# Altium project 4.0 - Nonisolated_DCDC_3BUCK-1BOOST_AUX_Power.PrjPcb
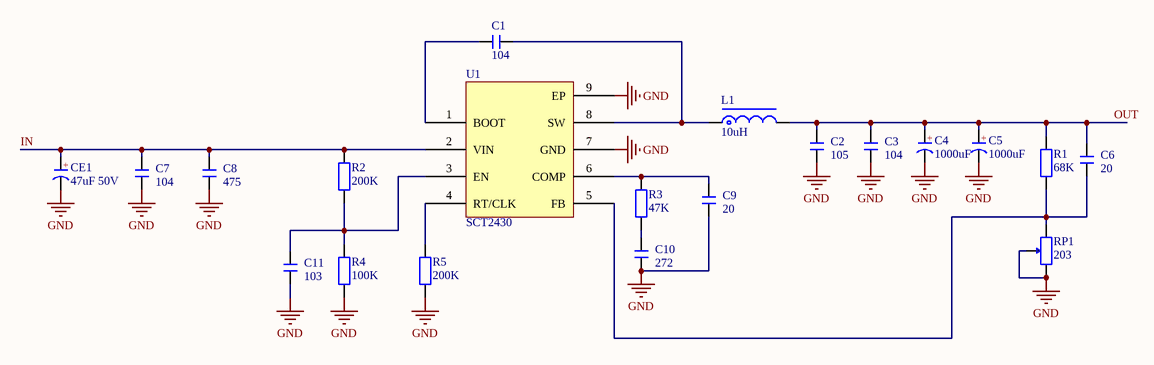
[diagram p0: SCT2XX0 STEP-DOWM.SchDoc]
2 sheets, 39 parts. Net scope: global (net labels, ports and power ports of the same name join across sheets).
Board file: Power Board.PcbDoc
Sheets:
  SCT2XX0 STEP-DOWM.SchDoc
  SCT12A0 BOOST.SchDoc

## Sheet SCT2XX0 STEP-DOWM.SchDoc
size A4; Organization: Altium Limited; Address1: L3, 12a Rodborough Rd; Address2: Frenchs Forest; Address3: NSW; Address4: Australia 2086

### Parts
C1  104  [C 0805_L]
C2  105  [C 0805_L]
C3  104  [C 0805_L]
C4  1000uF  [CAP 7.5*16*25]
C5  1000uF  [CAP 5.0*12.5*20]
C6  20  [C 0805_L]
C7  104  [C 0805_L]
C8  475  [C 0805_L]
C9  20  [C 0805_L]
C10  272  [C 0805_L]
C11  103  [C 0805_L]
CE1  47uF 50V  [CM C(5*5.4)]
L1  10uH  [CDRH127]
R1  68K  [R 0805_L]
R2  200K  [R 0805_L]
R3  47K  [R 0805_L]
R4  100K  [R 0805_L]
R5  200K  [R 0805_L]
RP1  203  [3296W]
U1  SCT2430  [ESOP8_N]

### Nets
GND: C2.1 C3.1 C4.2(K) C5.2(K) C7.1 C8.1 C9.1 C10.1 C11.1 CE1.2(K) R4.1 R5.1 RP1.1 RP1.2 U1.7(GND) U1.9(EP)
IN: C7.2 C8.2 CE1.1(A) R2.2 U1.2(VIN)
OUT: C2.2 C3.2 C4.1(A) C5.1(A) C6.2 L1.2 R1.2
NetC1_1: C1.1 U1.1(BOOT)
NetC1_2: C1.2 L1.1 U1.8(SW)
NetC6_1: C6.1 R1.1 RP1.3 U1.5(FB)
NetC9_2: C9.2 R3.2 U1.6(COMP)
NetC10_2: C10.2 R3.1
NetC11_2: C11.2 R2.1 R4.2 U1.3(EN)
NetR5_2: R5.2 U1.4(RT/CLK)

### Notes on the sheet
- Title
- Size:
- Date:
- A4
- Number:
- Time:
- Revision:
- Sheet
- of
- File:
- (in symbol CE) +
- (in symbol CE_SMD) +

### Library data of the parts
C1-C3 C6-C11 = C: 贴片电容; 淘宝ID: 小糖豆的小窝窝; BOM名称: 贴片电容; 下单链接: https://item.taobao.com/item.htm?ft=t&id=613637044352
C4 C5 = CE: 直插电解电容; 淘宝ID: 小糖豆的小窝窝; BOM名称: 直插电解电容; 下单链接: https://item.taobao.com/item.htm?ft=t&id=613637044352
CE1 = CE_SMD: 贴片电解电容; 淘宝ID: 小糖豆的小窝窝; BOM名称: 贴片电解电容; 下单链接: https://item.taobao.com/item.htm?ft=t&id=613637044352
L1 = L-CDRH: 功率屏蔽电感; 淘宝ID: 小糖豆的小窝窝; BOM名称: 功率屏蔽电感; 下单链接: https://item.taobao.com/item.htm?ft=t&id=613637044352
R1-R5 = R: 贴片电阻; 淘宝ID: 小糖豆的小窝窝; BOM名称: 贴片电阻; 下单链接: https://item.taobao.com/item.htm?ft=t&id=613637044352
RP1 = RP: 单联电位器; 淘宝ID: 小糖豆的小窝窝; BOM名称: 单联电位器; 下单链接: https://item.taobao.com/item.htm?ft=t&id=613637044352

## Sheet SCT12A0 BOOST.SchDoc
size A4; Organization: Altium Limited; Address1: L3, 12a Rodborough Rd; Address2: Frenchs Forest; Address3: NSW; Address4: Australia 2086
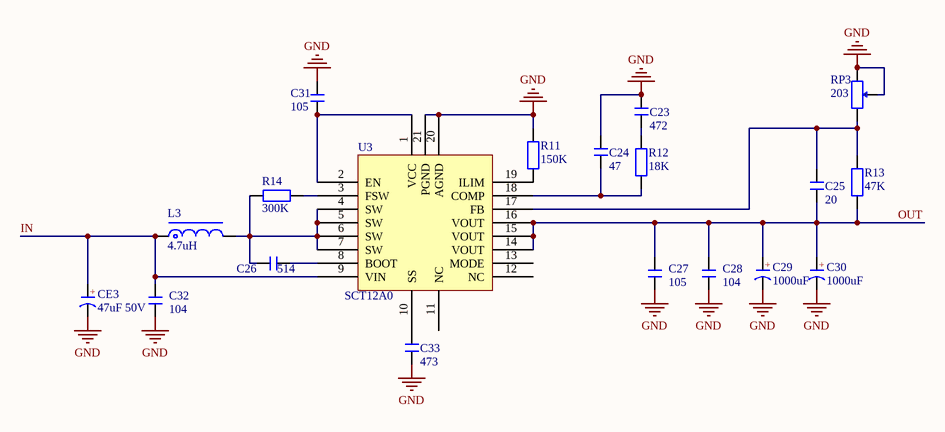
[diagram p1: SCT12A0 BOOST.SchDoc]

### Parts
C23  472  [C 0805_L]
C24  47  [C 0805_L]
C25  20  [C 0805_L]
C26  514  [C 0805_L]
C27  105  [C 0805_L]
C28  104  [C 0805_L]
C29  1000uF  [CAP 7.5*16*25]
C30  1000uF  [CAP 5.0*12.5*20]
C31  105  [C 0805_L]
C32  104  [C 0805_L]
C33  473  [C 0805_L]
CE3  47uF 50V  [CM C(5*5.4)]
L3  4.7uH  [CDRH127]
R11  150K  [R 0805_L]
R12  18K  [R 0805_L]
R13  47K  [R 0805_L]
R14  300K  [R 0805_L]
RP3  203  [3296W]
U3  SCT12A0  [DFN-20L (3.5x4.5)]

### Nets
GND: C23.1 C24.1 C27.1 C28.1 C29.2(K) C30.2(K) C31.1 C32.1 C33.1 CE3.2(K) R11.1 RP3.1 RP3.2 U3.20(AGND) U3.21(PGND)
IN: C32.2 CE3.1(A) L3.1 U3.9(VIN)
OUT: C25.2 C27.2 C28.2 C29.1(A) C30.1(A) R13.2 U3.14(VOUT) U3.15(VOUT) U3.16(VOUT)
NetC23_2: C23.2 R12.1
NetC24_2: C24.2 R12.2 U3.18(COMP)
NetC25_1: C25.1 R13.1 RP3.3 U3.17(FB)
NetC26_1: C26.1 U3.8(BOOT)
NetC26_2: C26.2 L3.2 R14.1 U3.4(SW) U3.5(SW) U3.6(SW) U3.7(SW)
NetC31_2: C31.2 U3.1(VCC) U3.2(EN)
NetC33_2: C33.2 U3.10(SS)
NetR11_2: R11.2 U3.19(ILIM)
NetR14_2: R14.2 U3.3(FSW)

Not connected (* = marked no-connect by the designer): U3 11(NC) 12(NC) 13(MODE)

### Notes on the sheet
- Title
- Size:
- Date:
- File:
- A0
- Number:
- Time:
- Revision:
- Sheet
- of
- (in symbol CE) +
- (in symbol CE_SMD) +

### Library data of the parts
C23-C28 C31-C33 = C: 贴片电容; 淘宝ID: 小糖豆的小窝窝; BOM名称: 贴片电容; 下单链接: https://item.taobao.com/item.htm?ft=t&id=613637044352
C29 C30 = CE: 直插电解电容; 淘宝ID: 小糖豆的小窝窝; BOM名称: 直插电解电容; 下单链接: https://item.taobao.com/item.htm?ft=t&id=613637044352
CE3 = CE_SMD: 贴片电解电容; 淘宝ID: 小糖豆的小窝窝; BOM名称: 贴片电解电容; 下单链接: https://item.taobao.com/item.htm?ft=t&id=613637044352
L3 = L-CDRH: 功率屏蔽电感; 淘宝ID: 小糖豆的小窝窝; BOM名称: 功率屏蔽电感; 下单链接: https://item.taobao.com/item.htm?ft=t&id=613637044352
R11-R14 = R: 贴片电阻; 淘宝ID: 小糖豆的小窝窝; BOM名称: 贴片电阻; 下单链接: https://item.taobao.com/item.htm?ft=t&id=613637044352
RP3 = RP: 单联电位器; 淘宝ID: 小糖豆的小窝窝; BOM名称: 单联电位器; 下单链接: https://item.taobao.com/item.htm?ft=t&id=613637044352

## Nets that join several sheets
GND: SCT2XX0 STEP-DOWM (16 pins), SCT12A0 BOOST (15 pins)
IN: SCT2XX0 STEP-DOWM (5 pins), SCT12A0 BOOST (C32.2 CE3.1 L3.1 U3.9)
OUT: SCT2XX0 STEP-DOWM (7 pins), SCT12A0 BOOST (9 pins)